# Altium schematic sheet rigidPCB.SchDoc
size A3; SheetNumber: 1; SheetTotal: 1
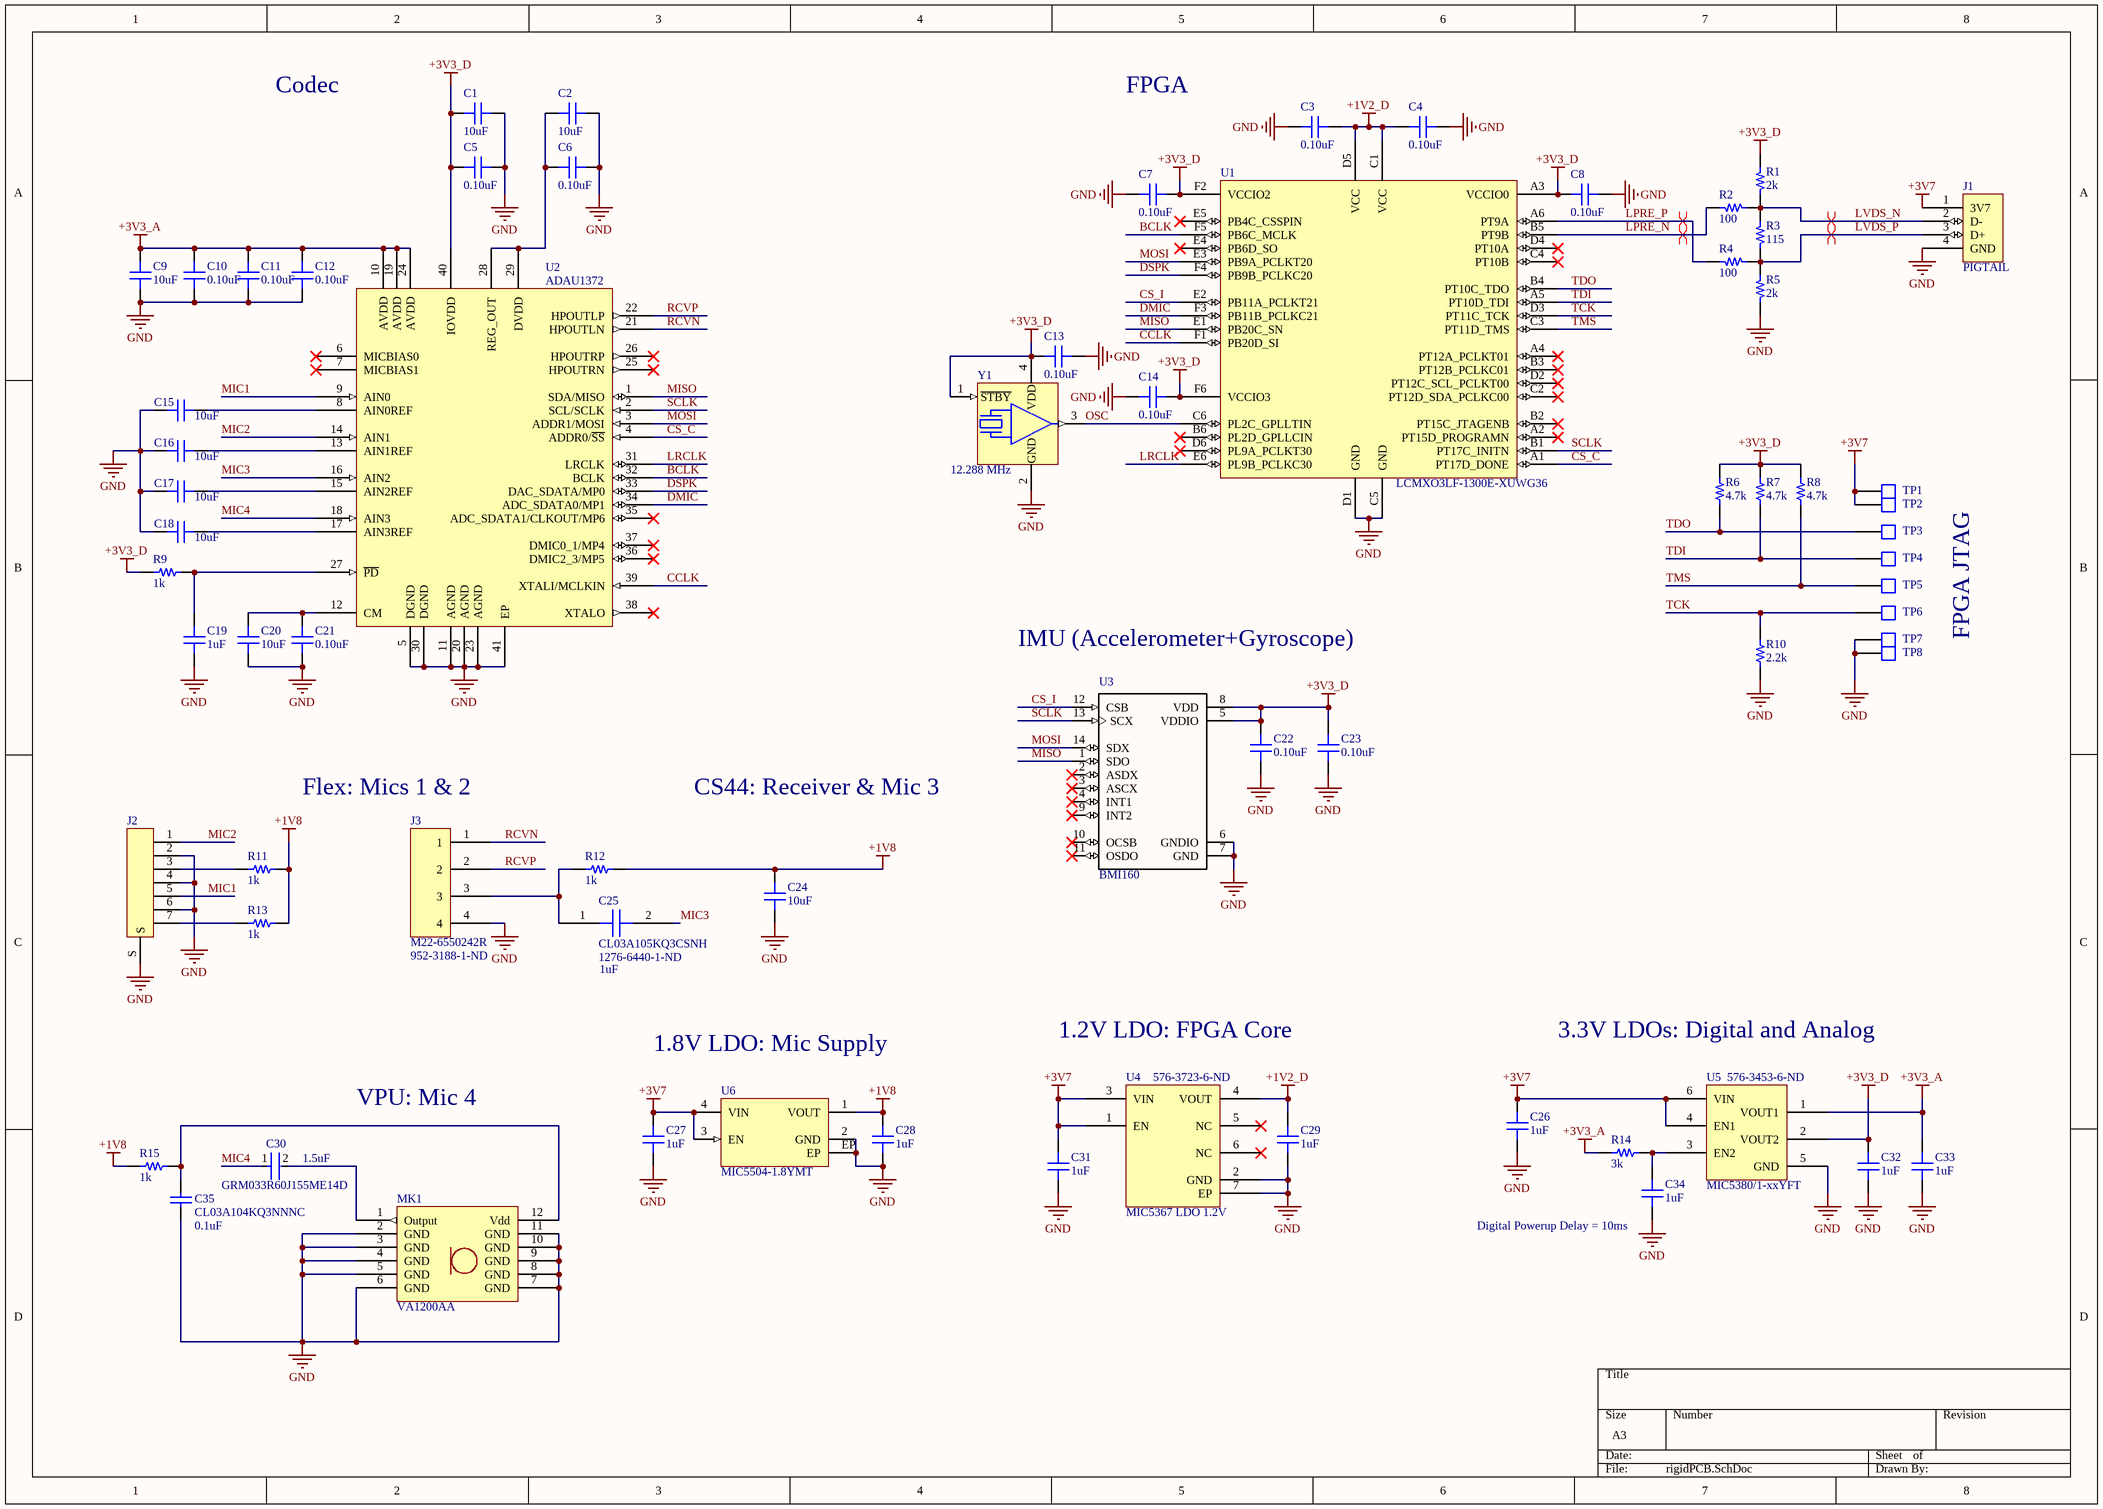
[diagram p0: rigidPCB.SchDoc]

## Parts
C1  10uF  [CAP 0402/1005]
C2  10uF  [CAP 0402/1005]
C3  0.10uF  [CAP 0201/0603]
C4  0.10uF  [CAP 0201/0603]
C5  0.10uF  [CAP 0201/0603]
C6  0.10uF  [CAP 0201/0603]
C7  0.10uF  [CAP 0201/0603]
C8  0.10uF  [CAP 0201/0603]
C9  10uF  [CAP 0402/1005]
C10  0.10uF  [CAP 0201/0603]
C11  0.10uF  [CAP 0201/0603]
C12  0.10uF  [CAP 0201/0603]
C13  0.10uF  [CAP 0201/0603]
C14  0.10uF  [CAP 0201/0603]
C15  10uF  [CAP 0402/1005]
C16  10uF  [CAP 0402/1005]
C17  10uF  [CAP 0402/1005]
C18  10uF  [CAP 0402/1005]
C19  1uF  [CAP 0201/0603]
C20  10uF  [CAP 0402/1005]
C21  0.10uF  [CAP 0201/0603]
C22  0.10uF  [CAP 0201/0603]
C23  0.10uF  [CAP 0201/0603]
C24  10uF  [CAP 0402/1005]
C25  CL03A105KQ3CSNH  Supplier Part Number 1: 1276-6440-1-ND  [CL03A105KQ3CSNH]
C26  1uF  [CAP 0201/0603]
C27  1uF  [CAP 0201/0603]
C28  1uF  [CAP 0201/0603]
C29  1uF  [CAP 0201/0603]
C30  GRM033R60J155ME14D  [FP-GRM033-0_03-IPC_B]
C31  1uF  [CAP 0201/0603]
C32  1uF  [CAP 0201/0603]
C33  1uF  [CAP 0201/0603]
C34  1uF  [CAP 0201/0603]
C35  CL03A104KQ3NNNC  [CAPC0603X33X15ML03T05]
J1  PIGTAIL  [PIGTAIL]
J2  FFC  [HIROSE_FH58M-7S-0.25SHW-99]  (value not drawn)
J3  M22-6550242R  Supplier Part Number 1: 952-3188-1-ND  [M22-6550242R]
MK1  VA1200AA  [VA1200AA]
R1  2k  [RES 0201/0603]
R2  100  [RES 0201/0603]
R3  115  [RES 0201/0603]
R4  100  [RES 0201/0603]
R5  2k  [RES 0201/0603]
R6  4.7k  [RES 0201/0603]
R7  4.7k  [RES 0201/0603]
R8  4.7k  [RES 0201/0603]
R9  1k  [RES 0201/0603]
R10  2.2k  [RES 0201/0603]
R11  1k  [RES 0201/0603]
R12  1k  [RES 0201/0603]
R13  1k  [RES 0201/0603]
R14  3k  [RES 0201/0603]
R15  1k  [RES 0201/0603]
TP1  TP_SMD_DJB  [TP_SMD_DJB]  (value not drawn)
TP2  TP_SMD_DJB  [TP_SMD_DJB]  (value not drawn)
TP3  TP_SMD_DJB  [TP_SMD_DJB]  (value not drawn)
TP4  TP_SMD_DJB  [TP_SMD_DJB]  (value not drawn)
TP5  TP_SMD_DJB  [TP_SMD_DJB]  (value not drawn)
TP6  TP_SMD_DJB  [TP_SMD_DJB]  (value not drawn)
TP7  TP_SMD_DJB  [TP_SMD_DJB]  (value not drawn)
TP8  TP_SMD_DJB  [TP_SMD_DJB]  (value not drawn)
U1  LCMXO3LF-1300E-XUWG36  [BGA36_WLCS_25x25_MachXO3]
U2  ADAU1372  [QFN40_LFCSP_WQ_6mmx6mm]
U3  BMI160  [LGA14R50P5X4_300X250X83]
U4  MIC5367 LDO 1.2V  Supplier Part Number 1: 576-3723-6-ND  [LDO 1.2V]
U5  MIC5380/1-xxYFT  Supplier Part Number 1: 576-3453-6-ND  [06L FCSTSLP]
U6  MIC5504-1.8YMT  [MICREL_DFN4]
Y1  12.288 MHz  [OSC_2.5x2.0mm]

## Nets
+1V2_D: C3.1 C4.2 C29.2 U1.C1(VCC) U1.D5(VCC) U4.4(VOUT)
+1V8: C24.2 C28.2 R11.2 R12.2 R13.2 R15.1 U6.1(VOUT)
+3V3_A: C9.1 C10.2 C11.2 C12.2 C33.2 R14.1 U2.10(AVDD) U2.19(AVDD) U2.24(AVDD) U5.1(VOUT1)
+3V3_D: C1.2 C5.1 C7.1 C8.2 C13.2 C14.1 C22.2 C23.2 C32.2 R1.2 R6.2 R7.2 R8.2 R9.1 U1.A3(VCCIO0) U1.F2(VCCIO2) U1.F6(VCCIO3) U2.40(IOVDD) U3.5(VDDIO) U3.8(VDD) U5.2(VOUT2) Y1.1(~{STBY}) Y1.4(VDD)
+3V7: C26.2 C27.2 C31.2 J1.1(3V7) TP1.1 TP2.1 U4.1(EN) U4.3(VIN) U5.4(EN1) U5.6(VIN) U6.3(EN) U6.4(VIN)
GND: C1.1 C2.1 C3.2 C4.1 C5.2 C6.2 C7.2 C8.1 C9.2 C10.1 C11.1 C12.1 C13.1 C14.2 C15.2 C16.2 C17.2 C18.2 C19.1 C20.2 C21.1 C22.1 C23.1 C24.1 C26.1 C27.1 C28.1 C29.1 C31.1 C32.1 C33.1 C34.1 C35.1 J1.4(GND) J2.2 J2.4 J2.6 J2.S J3.4 MK1.2(GND) MK1.3(GND) MK1.4(GND) MK1.5(GND) MK1.6(GND) MK1.7(GND) MK1.8(GND) MK1.9(GND) MK1.10(GND) MK1.11(GND) R5.1 R10.1 TP7.1 TP8.1 U1.C5(GND) U1.D1(GND) U2.5(DGND) U2.11(AGND) U2.20(AGND) U2.23(AGND) U2.30(DGND) U2.41(EP) U3.6(GNDIO) U3.7(GND) U4.2(GND) U4.7(EP) U5.5(GND) U6.2(GND) U6.EP Y1.2(GND)
BCLK: U1.F5(PB6C_MCLK) U2.32(BCLK)
CCLK: U1.F1(PB20D_SI) U2.39(XTALI/MCLKIN)
CS_C: U1.A1(PT17D_DONE) U2.4(ADDR0/~{SS})
CS_I: U1.E2(PB11A_PCLKT21) U3.12(CSB)
DMIC: U1.F3(PB11B_PCLKC21) U2.34(ADC_SDATA0/MP1)
DSPK: U1.F4(PB9B_PCLKC20) U2.33(DAC_SDATA/MP0)
LPRE_N: R2.2 U1.B5(PT9B)
LPRE_P: R4.2 U1.A6(PT9A)
LRCLK: U1.E6(PL9B_PCLKC30) U2.31(LRCLK)
LVDS_N: J1.2(D-) R1.1 R2.1 R3.2
LVDS_P: J1.3(D+) R3.1 R4.1 R5.2
MIC1: J2.5 U2.9(AIN0)
MIC2: J2.1 U2.14(AIN1)
MIC3: C25.2 U2.16(AIN2)
MIC4: C30.1 U2.18(AIN3)
MISO: U1.E1(PB20C_SN) U2.1(SDA/MISO) U3.1(SDO)
MOSI: U1.E3(PB9A_PCLKT20) U2.3(ADDR1/MOSI) U3.14(SDX)
OSC: U1.C6(PL2C_GPLLTIN) Y1.3(OUT)
RCVN: J3.1 U2.21(HPOUTLN)
RCVP: J3.2 U2.22(HPOUTLP)
SCLK: U1.B1(PT17C_INITN) U2.2(SCL/SCLK) U3.13(SCX)
TCK: R10.2 TP6.1 U1.D3(PT11C_TCK)
TDI: R7.1 TP4.1 U1.A5(PT10D_TDI)
TDO: R6.1 TP3.1 U1.B4(PT10C_TDO)
TMS: R8.1 TP5.1 U1.C3(PT11D_TMS)
NetC2_2: C2.2 C6.1 U2.28(REG_OUT) U2.29(DVDD)
NetC15_1: C15.1 U2.8(AIN0REF)
NetC16_1: C16.1 U2.13(AIN1REF)
NetC17_1: C17.1 U2.15(AIN2REF)
NetC18_1: C18.1 U2.17(AIN3REF)
NetC19_2: C19.2 R9.2 U2.27(~{PD})
NetC20_1: C20.1 C21.2 U2.12(CM)
NetC25_1: C25.1 J3.3 R12.1
NetC30_2: C30.2 MK1.1(Output)
NetC34_2: C34.2 R14.2 U5.3(EN2)
NetC35_2: C35.2 MK1.12(Vdd) R15.2
NetJ2_3: J2.3 R11.1
NetJ2_7: J2.7 R13.1

Not connected (* = marked no-connect by the designer): U1 A2(PT15D_PROGRAMN)* A4(PT12A_PCLKT01)* B2(PT15C_JTAGENB)* B3(PT12B_PCLKC01)* B6(PL2D_GPLLCIN)* C2(PT12D_SDA_PCLKC00)* C4(PT10B)* D2(PT12C_SCL_PCLKT00)* D4(PT10A)* D6(PL9A_PCLKT30)* E4(PB6D_SO)* E5(PB4C_CSSPIN)*; U2 6(MICBIAS0)* 7(MICBIAS1)* 25(HPOUTRN)* 26(HPOUTRP)* 35(ADC_SDATA1/CLKOUT/MP6)* 36(DMIC2_3/MP5)* 37(DMIC0_1/MP4)* 38(XTALO)*; U3 2(ASDX)* 3(ASCX)* 4(INT1)* 9(INT2)* 10(OCSB)* 11(OSDO)*; U4 5(NC)* 6(NC)*

## Layout directives
differential pair: LPRE_N, LPRE_P, LVDS_N, LVDS_P

## Notes on the sheet
- Codec
- FPGA
- IMU (Accelerometer+Gyroscope)
- FPGA JTAG
- (near J2) Flex: Mics 1 & 2
- (near J3) CS44: Receiver & Mic 3
- (near C25) 1uF
- 1.8V LDO: Mic Supply
- 1.2V LDO: FPGA Core
- 3.3V LDOs: Digital and Analog
- VPU: Mic 4
- (near C30) 1.5uF
- (near C35) 0.1uF
- (near C34) Digital Powerup Delay = 10ms

## Library data of the parts
C1 C2 C9 C15-C18 C20 C24 = C1005X5R0J106M050BC: CAP CER 10UF 6.3V X5R 0402; Manufacturer: TDK Corporation; TemperatureRange: -55C ~ 85C; Tolerance: 20%; Value: 10uF; Part Number: C1005X5R0J106M050BC; PartId: 12380; Supplier 1: Digi-Key; Supplier Part Number 1: 445-8920-2-ND; ComponentLink1Description: Datasheet; ComponentLink1URL: https://product.tdk.com/info/en/catalog/datasheets/mlcc_commercial_general_en.pdf; ComponentLink2Description: Digi-Key Listing; ComponentLink2URL: https://www.digikey.com/product-detail/en/tdk-corporation/C1005X5R0J106M050BC/445-8920-2-ND/3507809; TemperatureCoefficient: X5R; Voltage: 6.3V; Price: 0.119; Device Package: 0402 (1005 Metric)
C3-C8 C10-C14 C21-C23 = CL03A104KP3NNNC: CAP CER 0.1UF 10V X5R 0201; Manufacturer: Samsung Electro-Mechanics America, Inc.; TemperatureRange: -55C ~ 85C; Tolerance: 10%; Value: 0.10uF; Part Number: CL03A104KP3NNNC; PartId: 20562; Supplier 1: Digi-Key; Supplier Part Number 1: 1276-1115-2-ND; ComponentLink1Description: Datasheet; ComponentLink1URL: http://www.samsungsem.com/kr/support/product-search/mlcc/__icsFiles/afieldfile/2016/08/18/S_CL03A104KP3NNND.pdf; ComponentLink2Description: Digi-Key Listing; ComponentLink2URL: https://www.digikey.com/product-detail/en/samsung-electro-mechanics-america-inc/CL03A104KP3NNNC/1276-1115-2-ND/3886773; TemperatureCoefficient: X5R; Voltage: 10V; Price: 0.0031; Device Package: 0201 (0603 Metric)
C19 C26-C29 C31-C34 = 02016D105MAT2A: CAP CER 1UF 6.3V X5R 0201; Manufacturer: AVX Corporation; TemperatureRange: -55C ~ 85C; Tolerance: 20%; Value: 1uF; Part Number: 02016D105MAT2A; PartId: 20442; Supplier 1: Digi-Key; Supplier Part Number 1: 478-7862-2-ND; ComponentLink1Description: Datasheet; ComponentLink1URL: http://datasheets.avx.com/cx5r.pdf; ComponentLink2Description: Digi-Key Listing; ComponentLink2URL: https://www.digikey.com/product-detail/en/avx-corporation/02016D105MAT2A/478-7862-2-ND/3079664; TemperatureCoefficient: X5R; Voltage: 6.3V; Price: 0.063; Device Package: 0201 (0603 Metric)
C25 = CL03A105KQ3CSNH: 1 µF ±10% 6.3V Ceramic Capacitor X5R 0201 (0603 Metric); Supplier 1: Digi-Key
C30 = CMP-06035-017352-1: Chip Multilayer Ceramic Capacitors for General Purpose, 0201, 1.5uF, X5R, 15%, 20%, 6.3V; Case/Package: 0201; Packaging: Tape and Reel; Case Code (Imperial): 0201; Capacitance: 1.5uF; Max Operating Temperature: 85°C; Voltage Rating (DC): 6.3V; Dielectric: X5R; Min Operating Temperature: -55°C; Voltage Rating: 6.3V; Tolerance: 20%; Mount: Surface Mount; Case Code (Metric): 0603; Thickness: 0.013inch; Length: 0.024inch; Width: 0.012inch
C35 = CMP-2010-00674-1: Manufacturer: Samsung; Part Number: CL03A104KQ3NNNC
J2 = HIROSE_FH58M-7S-0.25SHW-99: Hirose FH58M-7S-0.25SHW(99) 7-pin Top+Bottom Contact FFC Connector
J3 = M22-6550242R: 4 Position Receptacle Connector 0.079" (2.00mm) Surface Mount, Right Angle Gold; Supplier 1: Digi-Key
MK1 = VA1200AA: Bone Conductor Sensor Accelerometer
R1 R5 = RC0201FR-072KL: RES SMD 2K OHM 1% 1/20W 0201; Manufacturer: Yageo; TemperatureRange: -55C ~ 125C; TemperatureCoefficient: 200ppm/C; PowerRating: 0.05W, 1/20W; Value: 2k; Part Number: RC0201FR-072KL; PartId: 19505; Supplier 1: Digi-Key; Supplier Part Number 1: YAG2280TR-ND; ComponentLink1Description: Datasheet; ComponentLink1URL: http://www.yageo.com/documents/recent/PYu-RC_Group_51_RoHS_L_04.pdf; ComponentLink2Description: Digi-Key Listing; ComponentLink2URL: https://www.digikey.com/product-detail/en/yageo/RC0201FR-072KL/YAG2280TR-ND/3202400; Tolerance: 1%; Price: 0.0042; Device Package: 0201 (0603 Metric)
R2 R4 = RC0603F101CS: RES SMD 100 OHM 1% 1/20W 0201; Manufacturer: Samsung Electro-Mechanics America, Inc.; TemperatureRange: -55C ~ 125C; TemperatureCoefficient: 250ppm/C; PowerRating: 0.05W, 1/20W; Value: 100; Part Number: RC0603F101CS; PartId: 19787; Supplier 1: Digi-Key; Supplier Part Number 1: 1276-3601-2-ND; ComponentLink1Description: Datasheet; ComponentLink1URL: //media.digikey.com/pdf/Data%20Sheets/Samsung%20PDFs/RC_Series_ds.pdf; ComponentLink2Description: Digi-Key Listing; ComponentLink2URL: https://www.digikey.com/product-detail/en/samsung-electro-mechanics-america-inc/RC0603F101CS/1276-3601-2-ND/3963908; Tolerance: 1%; Price: 0.0081; Device Package: 0201 (0603 Metric)
R3 = RC0201FR-07115RL: RES SMD 115 OHM 1% 1/20W 0201; Manufacturer: Yageo; TemperatureRange: -55C ~ 125C; TemperatureCoefficient: 200ppm/C; PowerRating: 0.05W, 1/20W; Value: 115; Part Number: RC0201FR-07115RL; PartId: 20289; Supplier 1: Digi-Key; Supplier Part Number 1: YAG2383TR-ND; ComponentLink1Description: Datasheet; ComponentLink1URL: http://www.yageo.com/documents/recent/PYu-RC_Group_51_RoHS_L_04.pdf; ComponentLink2Description: Digi-Key Listing; ComponentLink2URL: https://www.digikey.com/product-detail/en/yageo/RC0201FR-07115RL/YAG2383TR-ND/5280243; Tolerance: 1%; Price: 0.0042; Device Package: 0201 (0603 Metric)
R6-R8 = RC0201FR-074K7L: RES SMD 4.7K OHM 1% 1/20W 0201; Manufacturer: Yageo; TemperatureRange: -55C ~ 125C; TemperatureCoefficient: 200ppm/C; PowerRating: 0.05W, 1/20W; Value: 4.7k; Part Number: RC0201FR-074K7L; PartId: 19526; Supplier 1: Digi-Key; Supplier Part Number 1: 311-4.70KMTR-ND; ComponentLink1Description: Datasheet; ComponentLink1URL: http://www.yageo.com/documents/recent/PYu-RC_Group_51_RoHS_L_04.pdf; ComponentLink2Description: Digi-Key Listing; ComponentLink2URL: https://www.digikey.com/product-detail/en/yageo/RC0201FR-074K7L/311-4.70KMTR-ND/1948894; Tolerance: 1%; Price: 0.0056; Device Package: 0201 (0603 Metric)
R9 R11-R13 R15 = RC0201JR-071KL: RES SMD 1K OHM 5% 1/20W 0201; Manufacturer: Yageo; TemperatureRange: -55C ~ 125C; TemperatureCoefficient: 200ppm/C; PowerRating: 0.05W, 1/20W; Value: 1k; Part Number: RC0201JR-071KL; PartId: 19463; Supplier 1: Digi-Key; Supplier Part Number 1: 311-1KNTR-ND; ComponentLink1Description: Datasheet; ComponentLink1URL: http://www.yageo.com/documents/recent/PYu-RC_Group_51_RoHS_L_04.pdf; ComponentLink2Description: Digi-Key Listing; ComponentLink2URL: https://www.digikey.com/product-detail/en/yageo/RC0201JR-071KL/311-1KNTR-ND/1948922; Tolerance: 5%; Price: 0.0042; Device Package: 0201 (0603 Metric)
R10 = RC0603F222CS: RES SMD 2.2K OHM 1% 1/20W 0201; Manufacturer: Samsung Electro-Mechanics America, Inc.; TemperatureRange: -55C ~ 125C; TemperatureCoefficient: 250ppm/C; PowerRating: 0.05W, 1/20W; Value: 2.2k; Part Number: RC0603F222CS; PartId: 19542; Supplier 1: Digi-Key; Supplier Part Number 1: 1276-3634-2-ND; ComponentLink1Description: Datasheet; ComponentLink1URL: //media.digikey.com/pdf/Data%20Sheets/Samsung%20PDFs/RC_Series_ds.pdf; ComponentLink2Description: Digi-Key Listing; ComponentLink2URL: https://www.digikey.com/product-detail/en/samsung-electro-mechanics-america-inc/RC0603F222CS/1276-3634-2-ND/3963941; Tolerance: 1%; Price: 0.0019; Device Package: 0201 (0603 Metric)
R14 = RC0201FR-073KL: RES SMD 3K OHM 1% 1/20W 0201; Manufacturer: Yageo; TemperatureRange: -55C ~ 125C; TemperatureCoefficient: 200ppm/C; PowerRating: 0.05W, 1/20W; Value: 3k; Part Number: RC0201FR-073KL; PartId: 19520; Supplier 1: Digi-Key; Supplier Part Number 1: YAG2656TR-ND; ComponentLink1Description: Datasheet; ComponentLink1URL: http://www.yageo.com/documents/recent/PYu-RC_Group_51_RoHS_L_04.pdf; ComponentLink2Description: Digi-Key Listing; ComponentLink2URL: https://www.digikey.com/product-detail/en/yageo/RC0201FR-073KL/YAG2656TR-ND/5280516; Tolerance: 1%; Price: 0.0042; Device Package: 0201 (0603 Metric)
TP1-TP8 = TP_SMD_DJB: Digital Jellybean Style SMD Test Point; DNP: DNP
U1 = LCMXO3LF-1300E-XUWG36: Lattice MachXO3 36-ball 2.5x2.5mm FPGA
U2 = ADAU1372: Analog Devices CODEC
U3 = BMI160_1: BMI160 2.5 x 3 mm Tiaxial Accelerometer / Gyroscope Inertial Measurement Unit; MF: Bosch; Availability: Good; Package: LGA-14 Bosch; Price: 3.29 USD; MP: BMI160; Value: *
U5 = MIC5380/1-xxYFT: LDO 2fixed Outputs; Supplier 1: Digi-Key
U6 = MICREL_MIC5504-1.8YMT: Micrel MIC5504-1.8YMT 1.8V 300mA LDO
Y1 = MC_DSC1033DI2-012.2880: Microchip 12.288 MHz SMD MEMS Oscillator; DIGIKEY_PN: DSC1033DI2-012.2880-ND
U4 = MIC5367 LDO 1.2V: Supplier 1: Digi-Key